# EAGLE schematic H0FR10 (EAGLE 9.3.0)

## Sheet 1 of 2
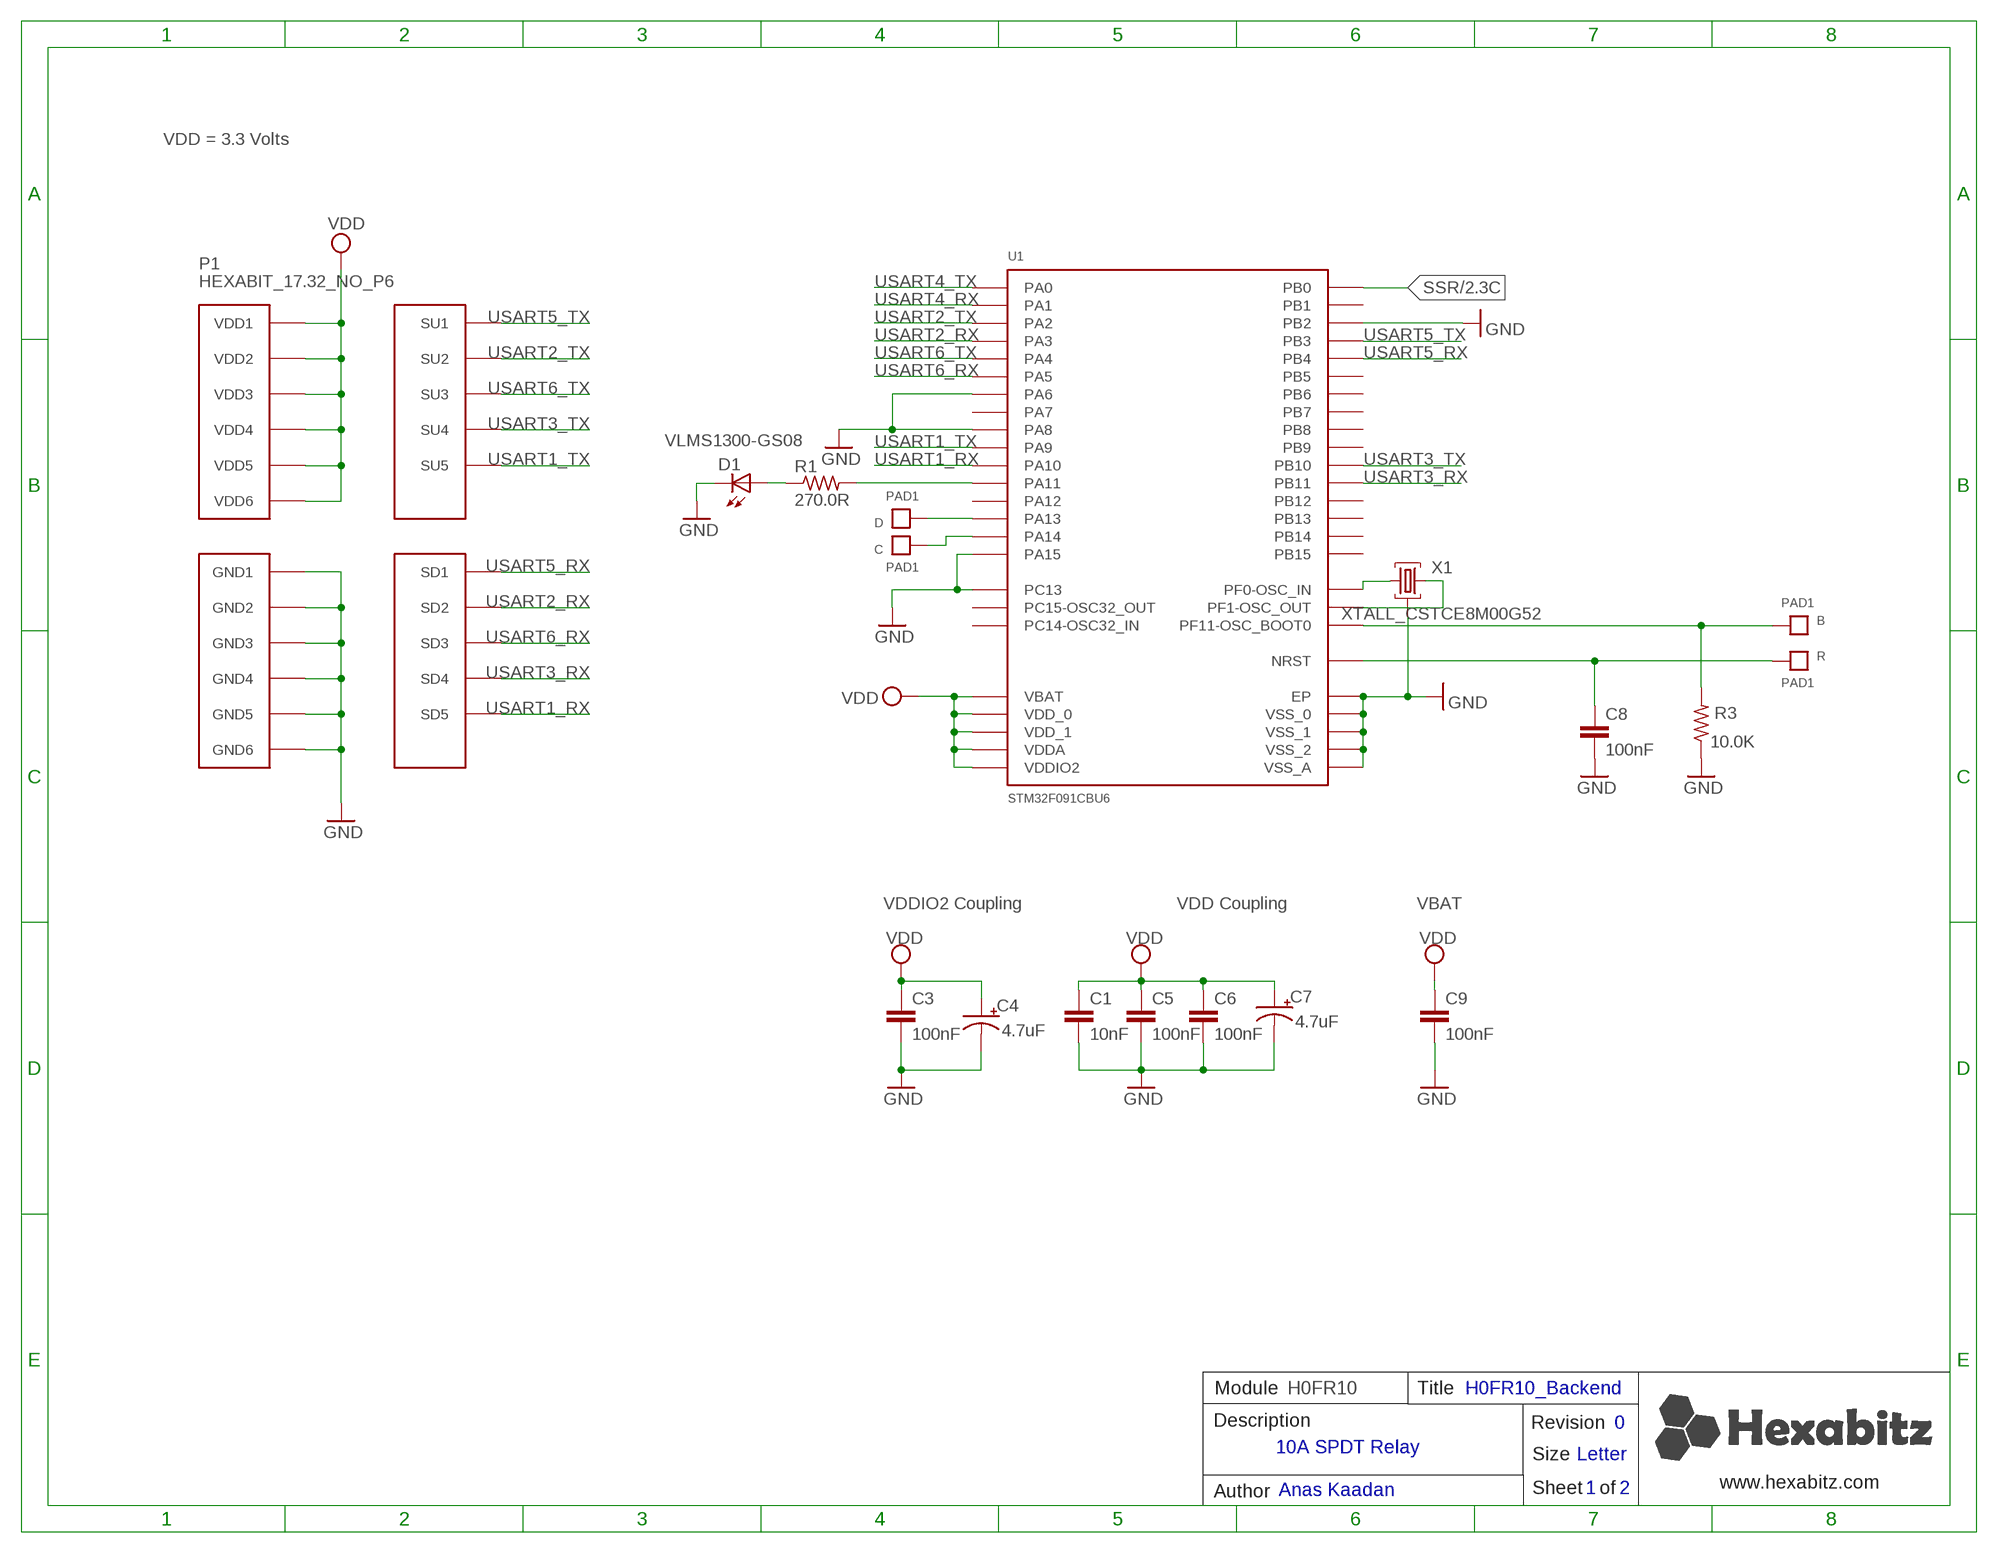
[diagram p0: schematic, sheet 1]

### Parts
B  PAD1  [PAD1]
C  PAD1  [PAD1]
C1  10nF  C-0603  [C-0603]
C3  100nF  C-0603  [C-0603]
C4  4.7uF  C-0805-POL  [C-0805-POL]
C5  100nF  C-0603  [C-0603]
C6  100nF  C-0603  [C-0603]
C7  4.7uF  C-0805-POL  [C-0805-POL]
C8  100nF  C-0603  [C-0603]
C9  100nF  C-0603  [C-0603]
D  PAD1  [PAD1]
D1  VLMS1300-GS08  [VLMS1300-GS08]
P1  HEXABIT_17.32_NO_P6  [HEXABIT_17.32_NO_P6]
R  PAD1  [PAD1]
R1  270.0R  R-0603  [R-0603]
R3  10.0K  R-0603  [R-0603]
U1  STM32F091CBU6  [STM32F091CBU6]
X1  XTALL_CSTCE8M00G52  [XTALL_CSTCE8M00G52]

### Nets
B1: B.P$1 B.P$2 R3.2 U1.P$44(PF11-OSC_BOOT0)
GND: C1.2 C3.2 C4.2(-) C5.2 C6.2 C7.2(-) C8.2 C9.2 D1.C P1.PAD_PD7(GND1) P1.PAD_PD8(GND2) P1.PAD_PD9(GND3) P1.PAD_PD10(GND4) P1.PAD_PD11(GND5) P1.PAD_PD12(GND6) R3.1 U1.EP U1.P$2(PC13) U1.P$8(VSS_A) U1.P$16(PA6) U1.P$20(PB2) U1.P$23(VSS_0) U1.P$29(PA8) U1.P$35(VSS_1) U1.P$38(PA15) U1.P$47(VSS_2) X1.P$2 ; also sheet 2
N$3: R1.2 U1.P$32(PA11)
N$4: D1.A R1.1
N$5: U1.P$5(PF0-OSC_IN) X1.P$1
N$6: U1.P$6(PF1-OSC_OUT) X1.P$3
N$7: D.P$1 D.P$2 U1.P$34(PA13)
N$9: C.P$1 C.P$2 U1.P$37(PA14)
R1: C8.1 R.P$1 R.P$2 U1.P$7(NRST)
SSR: U1.P$18(PB0) ; also sheet 2
USART1_RX: P1.PAD_PD5(SD5) U1.P$31(PA10)
USART1_TX: P1.PAD_PU5(SU5) U1.P$30(PA9)
USART2_RX: P1.PAD_PD2(SD2) U1.P$13(PA3)
USART2_TX: P1.PAD_PU2(SU2) U1.P$12(PA2)
USART3_RX: P1.PAD_PD4(SD4) U1.P$22(PB11)
USART3_TX: P1.PAD_PU4(SU4) U1.P$21(PB10)
USART4_RX: U1.P$11(PA1)
USART4_TX: U1.P$10(PA0)
USART5_RX: P1.PAD_PD1(SD1) U1.P$40(PB4)
USART5_TX: P1.PAD_PU1(SU1) U1.P$39(PB3)
USART6_RX: P1.PAD_PD3(SD3) U1.P$15(PA5)
USART6_TX: P1.PAD_PU3(SU3) U1.P$14(PA4)
VDD: C1.1 C3.1 C4.1(+) C5.1 C6.1 C7.1(+) C9.1 P1.PAD_PU7(VDD1) P1.PAD_PU8(VDD2) P1.PAD_PU9(VDD3) P1.PAD_PU10(VDD4) P1.PAD_PU11(VDD5) P1.PAD_PU12(VDD6) U1.P$1(VBAT) U1.P$9(VDDA) U1.P$24(VDD_0) U1.P$36(VDDIO2) U1.P$48(VDD_1) ; also sheet 2
Unconnected: U1.P$3(PC14-OSC32_IN) U1.P$4(PC15-OSC32_OUT) U1.P$17(PA7) U1.P$19(PB1) U1.P$25(PB12) U1.P$26(PB13) U1.P$27(PB14) U1.P$28(PB15) U1.P$33(PA12) U1.P$41(PB5) U1.P$42(PB6) U1.P$43(PB7) U1.P$45(PB8) U1.P$46(PB9)

### Notes on the sheet
- VDD = 3.3 Volts
- VDDIO2 Coupling | VDD Coupling | VBAT
- Module | H0FR10 | Title | H0FR10_Backend
- Description | Revision | 0
- 10A SPDT Relay
- Size | Letter
- www.hexabitz.com
- Author | Anas Kaadan | Sheet   of | 1 | 2
- C:/Users/Admin/Desktop/logodraft.bmp

## Sheet 2 of 2
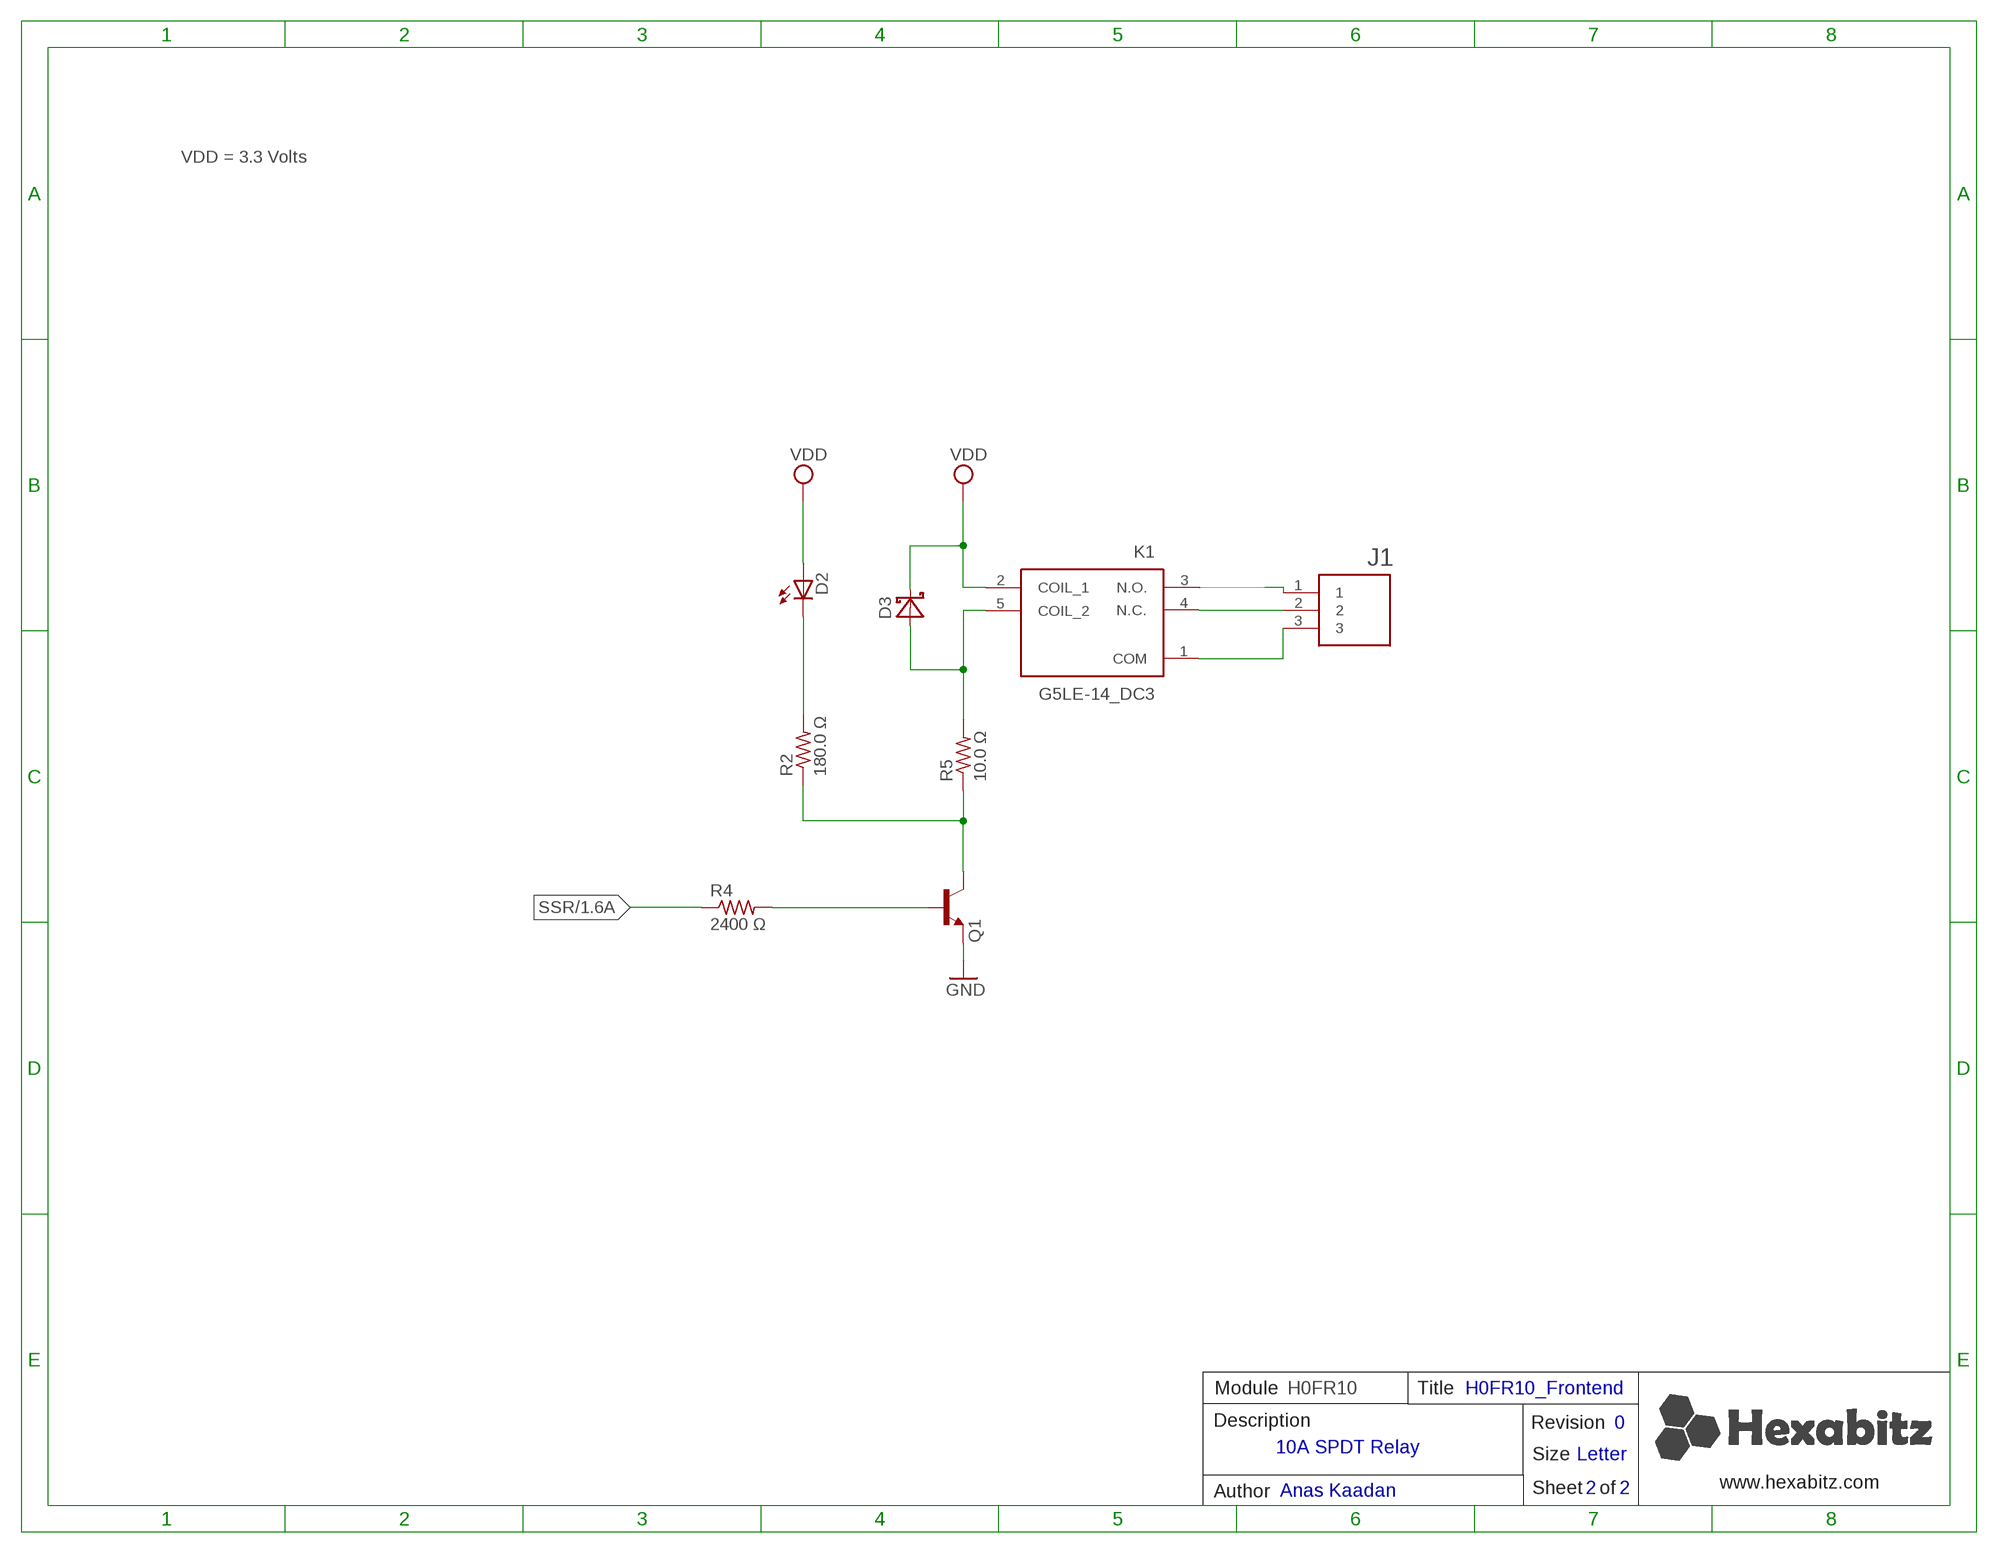
[diagram p1: schematic, sheet 2]

### Parts
D2  VLMS1300-GS08  [VLMS1300-GS08]
D3  SMD-DIODE-SCHOTTKY-40V-300MA(SOD-323)  [SOD-323]
J1  CON-PHOENIX-350_1755749  [SHDR3W100P0X508_1X3_1724X860X1]
K1  G5LE-14_DC3  [G5LE-14_SPDT]
Q1  MMBT3904LT1  [MMBT3904LT1]
R2  180.0 Ω  R-0603  [R-0603]
R4  2400 Ω  R-0603  [R-0603]
R5  10.0 Ω  R-0603  [R-0603]

### Nets
GND: Q1.2(E) ; also sheet 1
N$1: D3.+(A) K1.5(COIL_2) R5.2
N$2: J1.1 K1.3(N.O.)
N$8: D2.C R2.2
N$11: Q1.1(B) R4.2
N$12: J1.2 K1.4(N.C.)
N$13: J1.3 K1.1(COM)
N$15: Q1.3(C) R2.1 R5.1
SSR: R4.1 ; also sheet 1
VDD: D2.A D3.-(C) K1.2(COIL_1) ; also sheet 1

### Notes on the sheet
- VDD = 3.3 Volts
- Module | H0FR10 | Title | H0FR10_Frontend
- Description | Revision | 0
- 10A SPDT Relay
- Size | Letter
- www.hexabitz.com
- Author | Anas Kaadan | Sheet   of | 2 | 2

## Library data of the parts
B C D R = Hexabitz:PAD1
C1 = Hexabitz:C-0603: CAP CER 10% X7R 0603; CAPACITANCE: 10nF; MFN: KEMET; MPN: C0603C103K5RACTU; OCTOPART_URL: https://octopart.com/c0603c103k5ractu-kemet-133094?r=sp&s=R_iPBxLnSmGqhkU2rIMFpg; TOLERANCE: 10%; VOLTAGE_RATING: 50V
C3 C6 C8 = Hexabitz:C-0603: CAP CER 10% X7R 0603; CAPACITANCE: 100nF; MFN: KEMET; MPN: C0603C104K8RACTU; OCTOPART_URL: https://octopart.com/c0603c104k8ractu-kemet-145075?r=sp&s=9bS9ASSwSEqMCE9KBEQZ0g; TOLERANCE: 10%; VOLTAGE_RATING: 10V
C4 C7 = Hexabitz:C-0805-POL: Cap Tant Solid SMD 2012; CAPACITANCE: 4.7uF; MFN: Murata; MPN: GRM21BC81E475KA12L; OCTOPART_URL: https://octopart.com/grm21bc81e475ka12l-murata-10331911?r=sp&s=RY3qZSD8T6mG6TC9CHI5qQ; TOLERANCE: 10%; VOLTAGE_RATING: 25V
C5 = Hexabitz:C-0603: CAP CER 10% X7R 0603; CAPACITANCE: 100nF; MFN: KEMET; MPN: C0603C104K8RACTU; OCTOPART_URL: https://octopart.com/c0603c104k8ractu-kemet-145075?r=sp&s=9bS9ASSwSEqMCE9KBEQZ0g; TOLERANCE: 10%; VOLTAGE_RATING: 10
C9 = Hexabitz:C-0603: CAP CER 10% X7R 0603; CAPACITANCE: 100nF; MFN: KEMET; MPN: C0603C104K8RACTU; OCTOPART_URL: https://octopart.com/c0603c104k8ractu-kemet-145075?r=sp&s=9bS9ASSwSEqMCE9KBEQZ0g; TOLERANCE: 10V; VOLTAGE_RATING: 10%
D1 = Hexabitz:VLMS1300-GS08: Red 0603 130° Clear 54 mcd 2 V Surface Mount ChipLED ; Octopart Url : http://octopart.com/vlms1300-gs08-vishay-21709201; MFN: Vishay; MPN: VLMS1300-GS08; OCTOPART_URL: https://octopart.com/vlms1300-gs08-vishay-21709201?r=sp&s=_gcP4_q8T1SC6PJQPTQ9yA
D2 = Hexabitz:VLMS1300-GS08: Red 0603 130° Clear 54 mcd 2 V Surface Mount ChipLED ; Octopart Url : http://octopart.com/vlms1300-gs08-vishay-21709201; MFN: Vishay; MPN: VLMY1300-GS08; OCTOPART_URL: https://octopart.com/vlmy1300-gs08-vishay-21709204
D3 = Hexabitz:SMD-DIODE-SCHOTTKY-40V-300MA(SOD-323): 304020019; AVAILABILITY: Unavailable; DESCRIPTION: Diode Small Signal Schottky 40V 0.3A Automotive 2-Pin SOD-323 T/R; MF: STMicroelectronics; MP: BAT54JFILM; PACKAGE: SOD-323 STMicroelectronics; PRICE: None
J1 = Hexabitz:CON-PHOENIX-350_1755749: 3 way vertical PCB header,5.08mm pitch Phoenix Contact MSTBVA Series, 5.08mm Pitch 3 Way 1 Row Straight PCB Header, Solder Termination Source: Datasheet <https://componentsearchengine.com/Datasheets/1/1755749.pdf>; ALLIED_NUMBER: 70054652; ALLIED_PRICE-STOCK: https://www.alliedelec.com/phoenixcontact-1755749/70054652/; DESCRIPTION: 3 way vertical PCB header,5.08mm pitch Phoenix Contact MSTBVA Series, 5.08mm Pitch 3 Way 1 Row Straight PCB Header, Solder Termination; HEIGHT: 12mm; MANUFACTURER_NAME: Phoenix Contact; MANUFACTURER_PART_NUMBER: 1755749; MOUSER_PART_NUMBER: 651-1755749; MOUSER_PRICE-STOCK: https://www.mouser.com/Search/Refine.aspx?Keyword=651-1755749; RS_PART_NUMBER: 1896212; RS_PRICE-STOCK: https://uk.rs-online.com/web/p/products/1896212
K1 = Hexabitz:G5LE-14_DC3: General Purpose Relays Power PCB Relay Source: Datasheet <https://omronfs.omron.com/en_US/ecb/products/pdf/en-g5le.pdf>; DESCRIPTION: General Purpose Relays Power PCB Relay; HEIGHT: mm; MANUFACTURER_NAME: Omron Electronics; MANUFACTURER_PART_NUMBER: G5LE-14 DC3; MOUSER_PART_NUMBER: 653-G5LE-14DC3; MOUSER_PRICE-STOCK: https://www.mouser.com/Search/Refine.aspx?Keyword=653-G5LE-14DC3
P1 = hexabitz_connectors:HEXABIT_?_NO_P6: Hexabitz Hexagon Module Connector Hexagon side length = 17.32mm. The following ports are removed: P6
Q1 = Hexabitz:MMBT3904LT1: TRANS NPN 40V 0.2A SOT23; MFN: ON Semiconductor; MOUNTING_STYLE: Surface Mount; MPN: MMBT3904LT1G; NUM_OF_PINS: 3; OCTOPART_ID: 0bb6c2bc2200d471; OCTOPART_URL: http://octopart.com/mmbt3904lt1g-on+semiconductor-3280; PACKAGE: SOT-23-3; PACKAGING: Reel; POLARITY: NPN; POWER_DISSIPATION: 0.225 W; PRODUCT_CATEGORY: Transistors Bipolar-BJT; SERIES: MMBT3904L; VOLTAGE_RATING_DC: 40.0 V
R1 = Hexabitz:R-0603: Thick Film Resistors - SMD 0603; MFN: Yageo; MPN: RC0603FR-07270RL; OCTOPART_URL: https://octopart.com/search?q=RC0603FR-07270RL&start=0; RESISTANCE: 270.0 Ohm; TOLERANCE: 1%
R2 = Hexabitz:R-0603: Thick Film Resistors - SMD 0603; MFN: Yageo; MPN: RC0402FR-07100RL; OCTOPART_URL: https://octopart.com/erj-3geyj181v-panasonic-55403673; RESISTANCE: 180.0 Ω; TOLERANCE: ±5%
R3 = Hexabitz:R-0603: Thick Film Resistors - SMD 0603; MFN: Yageo; MPN: RC0603JR-0710KL; OCTOPART_URL: https://octopart.com/search?q=RC0603JR-0710KL&start=0; RESISTANCE: 10.0K Ohm; TOLERANCE: 5%
R4 = Hexabitz:R-0603: Thick Film Resistors - SMD 0603; MFN: Yageo; MPN: RC0603JR-070RL; OCTOPART_URL: https://octopart.com/crcw06032k40jnea-vishay-40298967; RESISTANCE: 2400.0 Ω; TOLERANCE: ±5%
R5 = Hexabitz:R-0603: Thick Film Resistors - SMD 0603; MFN: Vishay; MPN: CRCW060310R0FKEB; OCTOPART_URL: https://octopart.com/crcw060310r0fkeb-vishay-42507905?r=sp&s=5DGToXPzTKagwsiDJUkgpw; RESISTANCE: 10 Ohm; TOLERANCE: ±1%
U1 = Hexabitz:STM32F091CBU6: Description : ARM-based 32-bit MCU, CAN, 12 timers, ADC, DAC & Comm. Interface, 2 to 3.6 V, -40 to 85 degC, 48-Pin UFQFPN, RoHS, Tray ;Parameter : Ciiva URL : https://ciiva.com/part/STM32F091CBU6-20240708, CiivaID : 20240708, Clock Speed : 48000000.0 Hz, Lifecycle Status : Active, Mounting Style : Surface Mount, Number of Pins : 48, Octopart Url : https://octopart.com/stm32f091cbu6-stmicroelectronics-51988677, OctopartID : 5f4f955c32ec8088, RAM Memory Size : 32768 B, REACH SVHC Compliance : No SVHC, RoHS : Compliant,; MFN: STMicroelectronics; MPN: STM32F091CBU6; OCTOPART_URL: https://octopart.com/stm32f091cbu6-stmicroelectronics-51988677?r=sp&s=bU6fpgsrTZOxHyt7jkfh3w
X1 = Hexabitz:XTALL_CSTCE8M00G52: MURATA CSTCE8M00G52-R0 RESONATOR, SMD, 8MHZ ; Octopart Url : https://octopart.com/cstce8m00g52-r0-murata-7145559; MFN: Murata; MPN: CSTCE8M00G52Z-R0; OCTOPART_URL: https://octopart.com/cstce8m00g52z-r0-murata-17755941?r=sp&s=JDnNJnrHQhyS8Zk4ofFWXw